# Altium schematic sheet LOGGING.SchDoc
size A4
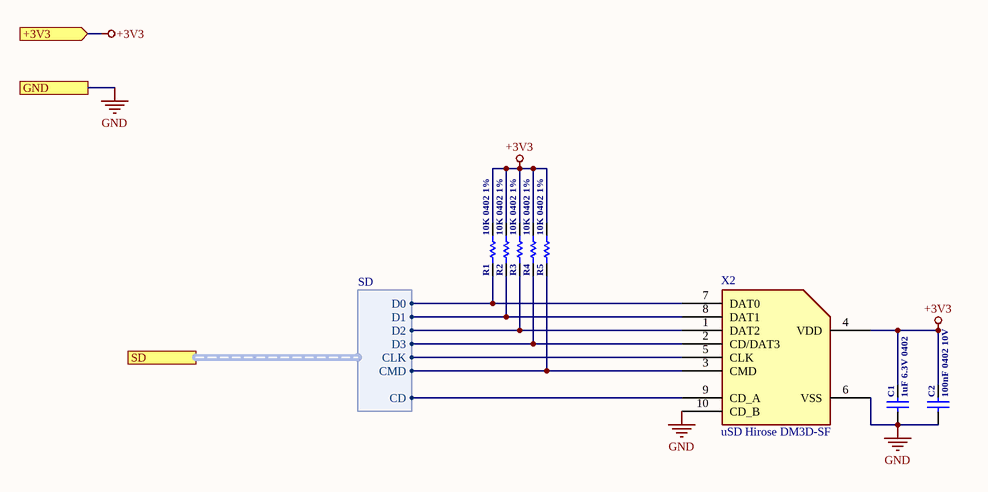
[diagram p0: LOGGING.SchDoc]

## Parts
C1  1uF 6.3V 0402
C2  100nF 0402 10V
R1  10K 0402 1%  [Resistor_0402]
R2  10K 0402 1%  [Resistor_0402]
R3  10K 0402 1%  [Resistor_0402]
R4  10K 0402 1%  [Resistor_0402]
R5  10K 0402 1%  [Resistor_0402]
X2  uSD Hirose DM3D-SF

## Ports
+3V3 (in), GND, SD (harness SD)

## Harnesses
SD: CD, CMD, CLK, D0, D1, D2, D3

## Nets
+3V3: C1.2 C2.2 R1.2 R2.2 R3.2 R4.2 R5.2 X2.4(VDD) ; port +3V3
GND: C1.1 C2.1 X2.6(VSS) X2.10(CD_B) ; port GND
NetR1_1: R1.1 X2.7(DAT0) ; port SD.D0
NetR2_1: R2.1 X2.8(DAT1) ; port SD.D1
NetR3_1: R3.1 X2.1(DAT2) ; port SD.D2
NetR4_1: R4.1 X2.2(CD/DAT3) ; port SD.D3
NetR5_1: R5.1 X2.3(CMD) ; port SD.CMD
NetX2_5: X2.5(CLK) ; port SD.CLK
NetX2_9: X2.9(CD_A) ; port SD.CD

## Library data of the parts
C1 = CL05A105KQ5NNNC 1uF 0402: SAMSUNG ELECTRO-MECHANICS - CL05A105KQ5NNNC - SMD Multilayer Ceramic Capacitor, 1 µF, 6.3 V, 0402 [1005 Metric], ± 10%, X5R, CL Series; Capacitance: 1000000 pF; Supplier 1: Digi-Key; Manufacturer: Samsung; Manufacturer Part Number: CL05A105KQ5NNNC; Stock 1: 2633061; Pricing 1: 1=0.1, 10=0.019, 50=0.0106, 100=0.0087, 500=0.0062, 1000=0.0049, 2500=0.0044, 5000=0.0041 (USD); Case Size/Dimension: 0402; Dielectric: X5R; Tolerance (%): ±10 %; Rated Voltage: 6.3 V; ComponentLink1URL: http://www.samsungsem.com/kr/support/product-search/mlcc/CL05A105KQ5NNNC.jsp?src-supplier=Digi-Key; ComponentLink1Description: http://www.samsungsem.com/kr/support/product-search/mlcc/CL05A105KQ5NNNC.jsp?src-supplier=Digi-Key; ComponentLink2URL: http://www1.futureelectronics.com/doc/SAMSUNG%20PASSIVE/CL05B104KQ5NNNC.pdf?src-supplier=Future+Electronics; ComponentLink2Description: http://www1.futureelectronics.com/doc/SAMSUNG%20PASSIVE/CL05B104KQ5NNNC.pdf?src-supplier=Future+Electronics; ComponentLink3URL: https://www.verical.com/server-webapp/html/getDatasheet?partID=358391&src-supplier=Verical; ComponentLink3Description: https://www.verical.com/server-webapp/html/getDatasheet?partID=358391&src-supplier=Verical; ComponentLink4URL: https://produktinfo.conrad.com/datenblaetter/450000-474999/459172-da-01-en-VS_KONDENSATOR_0402.pdf?src-supplier=Conrad; ComponentLink4Description: https://produktinfo.conrad.com/datenblaetter/450000-474999/459172-da-01-en-VS_KONDENSATOR_0402.pdf?src-supplier=Conrad; Supplier Part Number 1: 1276-1010-1-ND; Value: 1uF 6.3V 0402
C2 = CL05A104KP5NNNC 100nF 0402 10V: Cap Ceramic 0.1uF 10V X5R 10% SMD 0402 85C Paper T/R; Manufacturer: Samsung; Capacitance: 100000 pF; Supplier 1: Digi-Key; Manufacturer Part Number: CL05A104KP5NNNC; Stock 1: 5595689; Pricing 1: 1=0.1, 10=0.021, 50=0.0116, 100=0.0094, 500=0.0067, 1000=0.0053, 2500=0.0048, 5000=0.0044 (USD); Case Size/Dimension: 0402; Dielectric: X5R; Tolerance (%): ±10 %; Rated Voltage: 10 V; ComponentLink1URL: https://www.distrelec.biz/Web/Downloads/_e/ng/MLCC_CatalogDownload2013_ENG.pdf?mime=application%2Fpdf&src-supplier=Distrelec; ComponentLink1Description: https://www.distrelec.biz/Web/Downloads/_e/ng/MLCC_CatalogDownload2013_ENG.pdf?mime=application%2Fpdf&src-supplier=Distrelec; ComponentLink2URL: https://media.digikey.com/pdf/Data%20Sheets/Samsung%20PDFs/CL_Series_MLCC_ds.pdf?src-supplier=Digi-Key; ComponentLink2Description: https://media.digikey.com/pdf/Data%20Sheets/Samsung%20PDFs/CL_Series_MLCC_ds.pdf?src-supplier=Digi-Key; ComponentLink3URL: http://www1.futureelectronics.com/doc/SAMSUNG%20PASSIVE/CL05B104KQ5NNNC.pdf?src-supplier=Future+Electronics; ComponentLink3Description: http://www1.futureelectronics.com/doc/SAMSUNG%20PASSIVE/CL05B104KQ5NNNC.pdf?src-supplier=Future+Electronics; ComponentLink4URL: https://www.verical.com/server-webapp/html/getDatasheet?partID=358611&src-supplier=Verical; ComponentLink4Description: https://www.verical.com/server-webapp/html/getDatasheet?partID=358611&src-supplier=Verical; Supplier Part Number 1: 1276-1022-1-ND; Value: 100nF 0402 10V
R1-R5 = AC0402FR-0710KL 10K 0402 1%: RES SMD 10K OHM 1% 1/16W 0402; Manufacturer: Yageo; Resistance: 10 kOhms; Power Rating: 62.5 mW (1/16 W); Voltage Rating: 50 V; Temperature Coefficient: 100 PPM / C; Supplier 1: Digi-Key; Manufacturer Part Number: AC0402FR-0710KL; Stock 1: 1375478; Pricing 1: 1=0.1, 10=0.021, 100=0.0086, 1000=0.0039, 2500=0.0033, 5000=0.0028 (USD); Termination Style: SMD/SMT; Product: Thick Film Resistors SMD; Tolerance: 1 %; Case Code - in: 0402; Case Code - mm: 1005; Series: AC; Operating Temperature Range: - 55 C to + 155 C; Packaging: Reel; ComponentLink1URL: http://www.mouser.com/ds/2/447/yageodocoutput-1111992.pdf?src-supplier=Mouser; ComponentLink1Description: http://www.mouser.com/ds/2/447/yageodocoutput-1111992.pdf?src-supplier=Mouser; Supplier Part Number 1: YAG3436CT-ND; Value: 10K 0402 1%
X2 = DM3D-SF: HIROSE(HRS) - DM3D-SF - Memory Socket, microSD Series, Memory Socket, 8 Contacts, Copper Alloy, Gold Plated Contacts; Product Training Modules: DM3 Series microSD Card Sockets; Featured Product: dm3d-series; HTML Datasheet: DM3 Series microSD.html; Card Type: Secure Digital - microSD™; Number of Positions: 10 (8 + 2); Connector Type: Connector; Insertion, Removal Method: Push In, Pull Out; Online Catalog: DM3 Series; Other Names: HR1941CT; Supplier 1: Digi-Key; Manufacturer: Hirose; Manufacturer Part Number: DM3D-SF; Stock 1: 0; Pricing 1: 1=1.65, 10=1.495, 25=1.4032, 50=1.342, 100=1.281, 250=1.159, 500=1.0675, 1000=0.915 (USD); Catalog Drawings: DM3D-SF; Standard Package: 1; Category: Connectors, Interconnects; Family: Memory Connectors - PC Card Sockets; Series: DM3; Packaging: Cut Tape (CT); Ejector Side: -; Mounting Type: Surface Mount, Right Angle; Features: Switch; Height Above Board: 0.061" (1.55mm); Mounting Feature: Normal, Standard - Top; Contact Finish: Gold; Contact Finish Thickness: -; ComponentLink1URL: http://www.farnell.com/datasheets/1697167.pdf?src-supplier=Element14; ComponentLink1Description: http://www.farnell.com/datasheets/1697167.pdf?src-supplier=Element14; ComponentLink2URL: http://www.farnell.com/datasheets/1697167.pdf?src-supplier=Farnell; ComponentLink2Description: http://www.farnell.com/datasheets/1697167.pdf?src-supplier=Farnell; ComponentLink3URL: http://uk.rs-online.com/webdocs/0fd1/0900766b80fd13c1.pdf?src-supplier=RSComponents; ComponentLink3Description: http://uk.rs-online.com/webdocs/0fd1/0900766b80fd13c1.pdf?src-supplier=RSComponents; ComponentLink4URL: http://www.hirose.co.jp/cataloge_hp/e60900232.pdf?src-supplier=Avnet; ComponentLink4Description: http://www.hirose.co.jp/cataloge_hp/e60900232.pdf?src-supplier=Avnet; ComponentLink5URL: http://www.hirose.co.jp/cataloge_hp/e60900232.pdf?src-supplier=Future+Electronics; ComponentLink5Description: http://www.hirose.co.jp/cataloge_hp/e60900232.pdf?src-supplier=Future+Electronics; ComponentLink6URL: https://www.verical.com/server-webapp/html/getDatasheet?partID=432464&src-supplier=Verical; ComponentLink6Description: https://www.verical.com/server-webapp/html/getDatasheet?partID=432464&src-supplier=Verical; ComponentLink7URL: https://www.hirose.com/product/en/download_file/key_name/DM3/category/Catalog/doc_file_id/49662/?file_category_id=4&item_id=195&is_series=1&src-supplier=Digi-Key; ComponentLink7Description: https://www.hirose.com/product/en/download_file/key_name/DM3/category/Catalog/doc_file_id/49662/?file_category_id=4&item_id=195&is_series=1&src-supplier=Digi-Key; Supplier Part Number 1: HR1941CT-ND